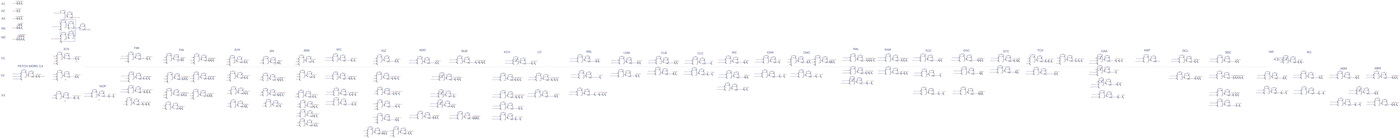
[diagram p0: schematic micro_instructions.asc, whole sheet]
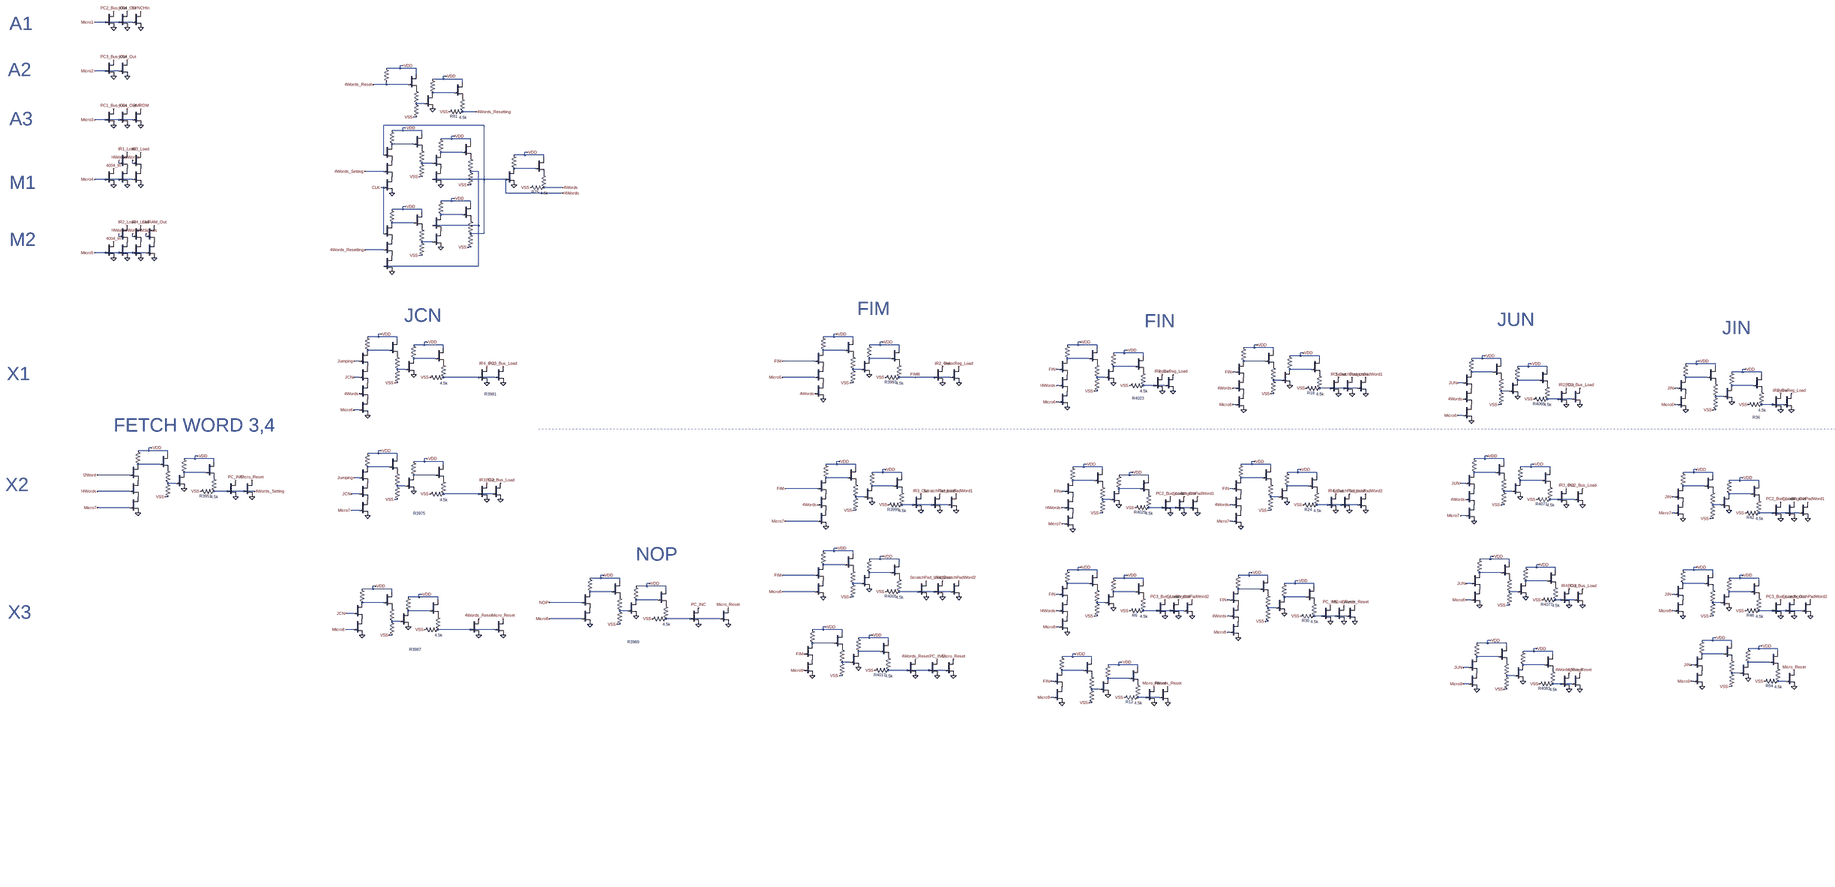
[diagram p1: schematic micro_instructions.asc, part, row 1 of 1, column 1 of 5]
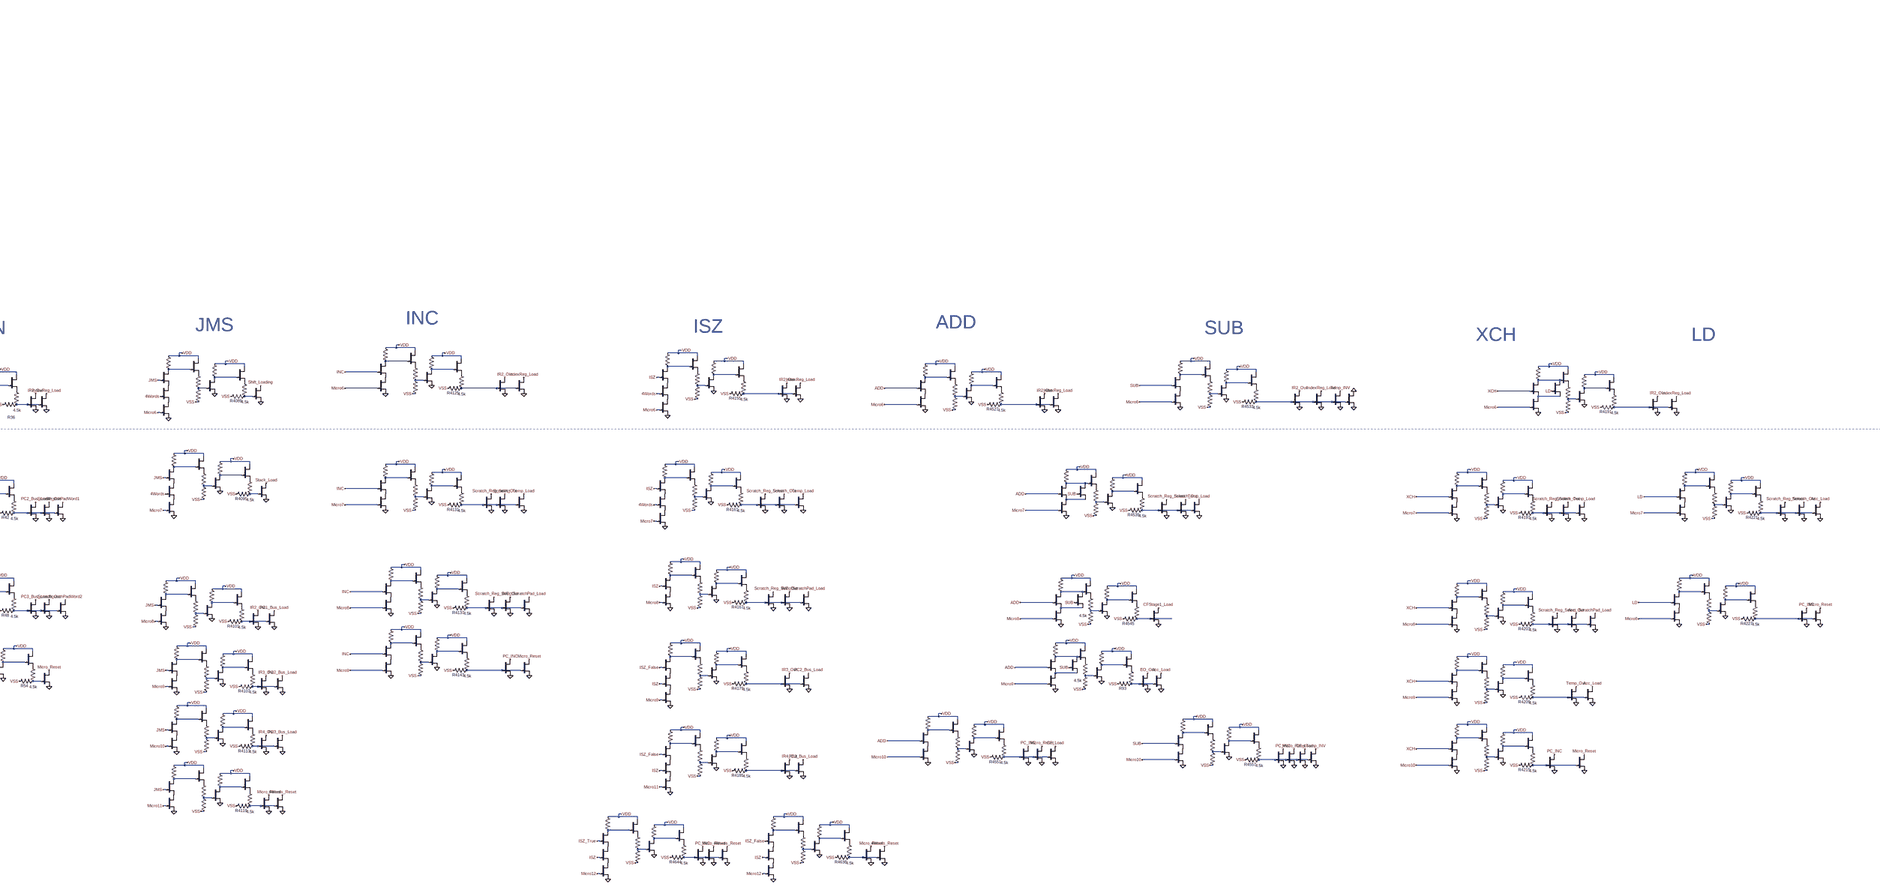
[diagram p2: schematic micro_instructions.asc, part, row 1 of 1, column 2 of 5]
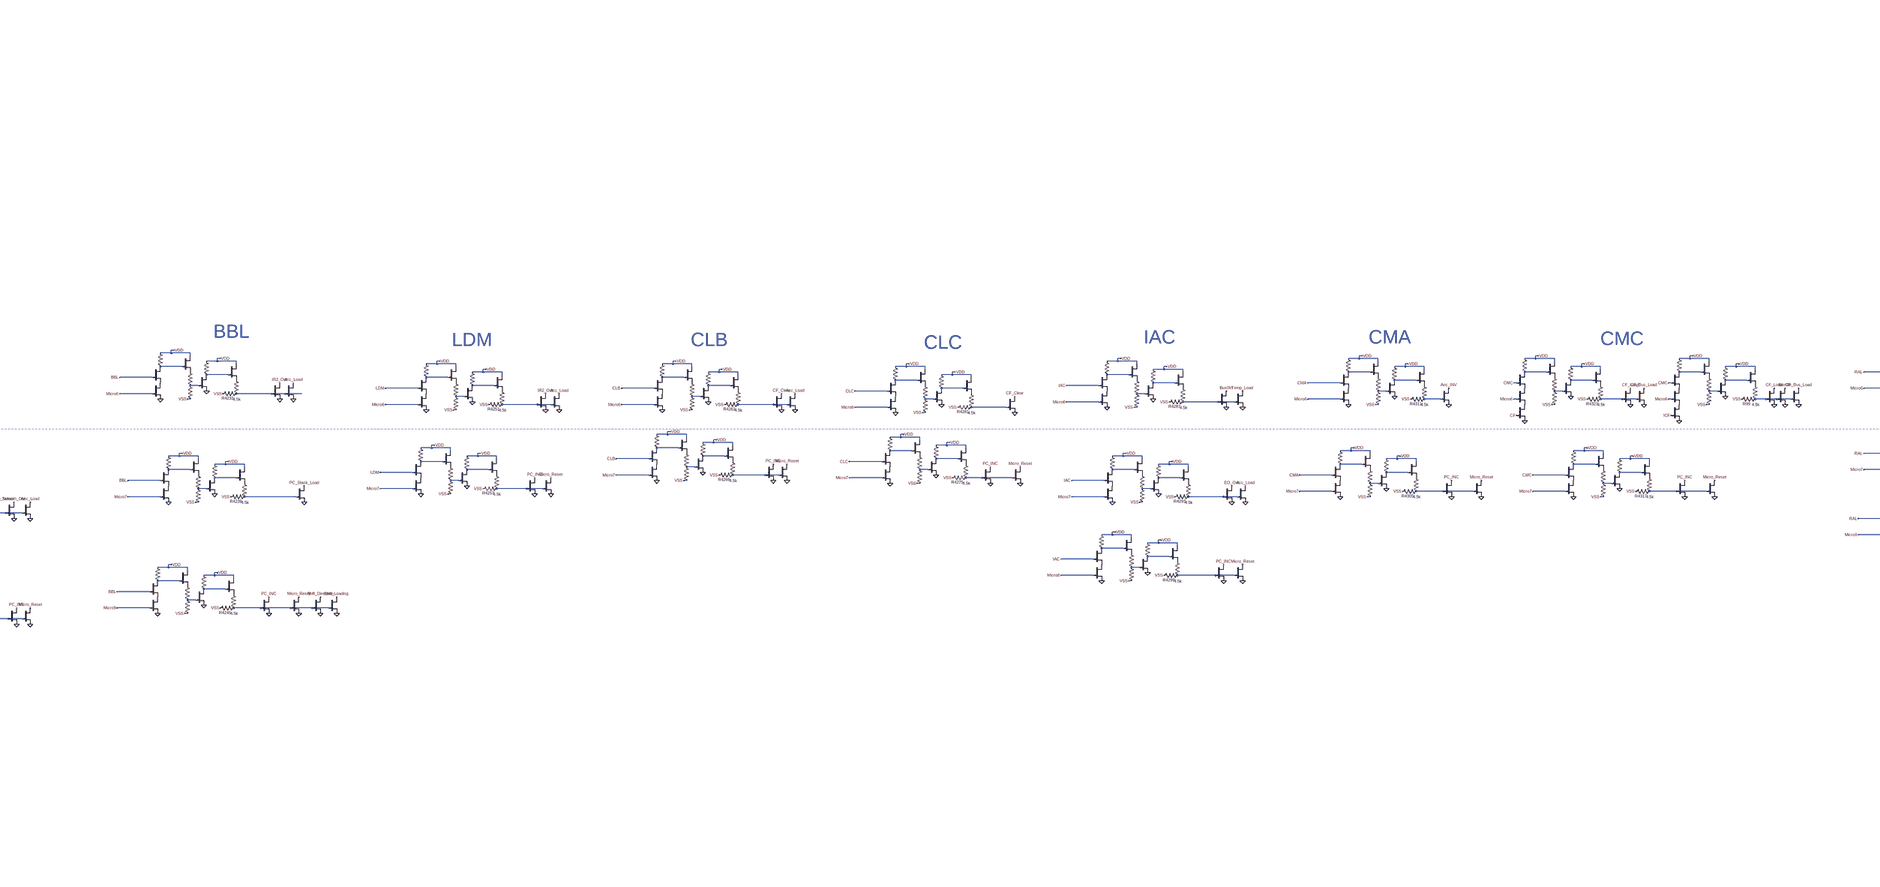
[diagram p3: schematic micro_instructions.asc, part, row 1 of 1, column 3 of 5]
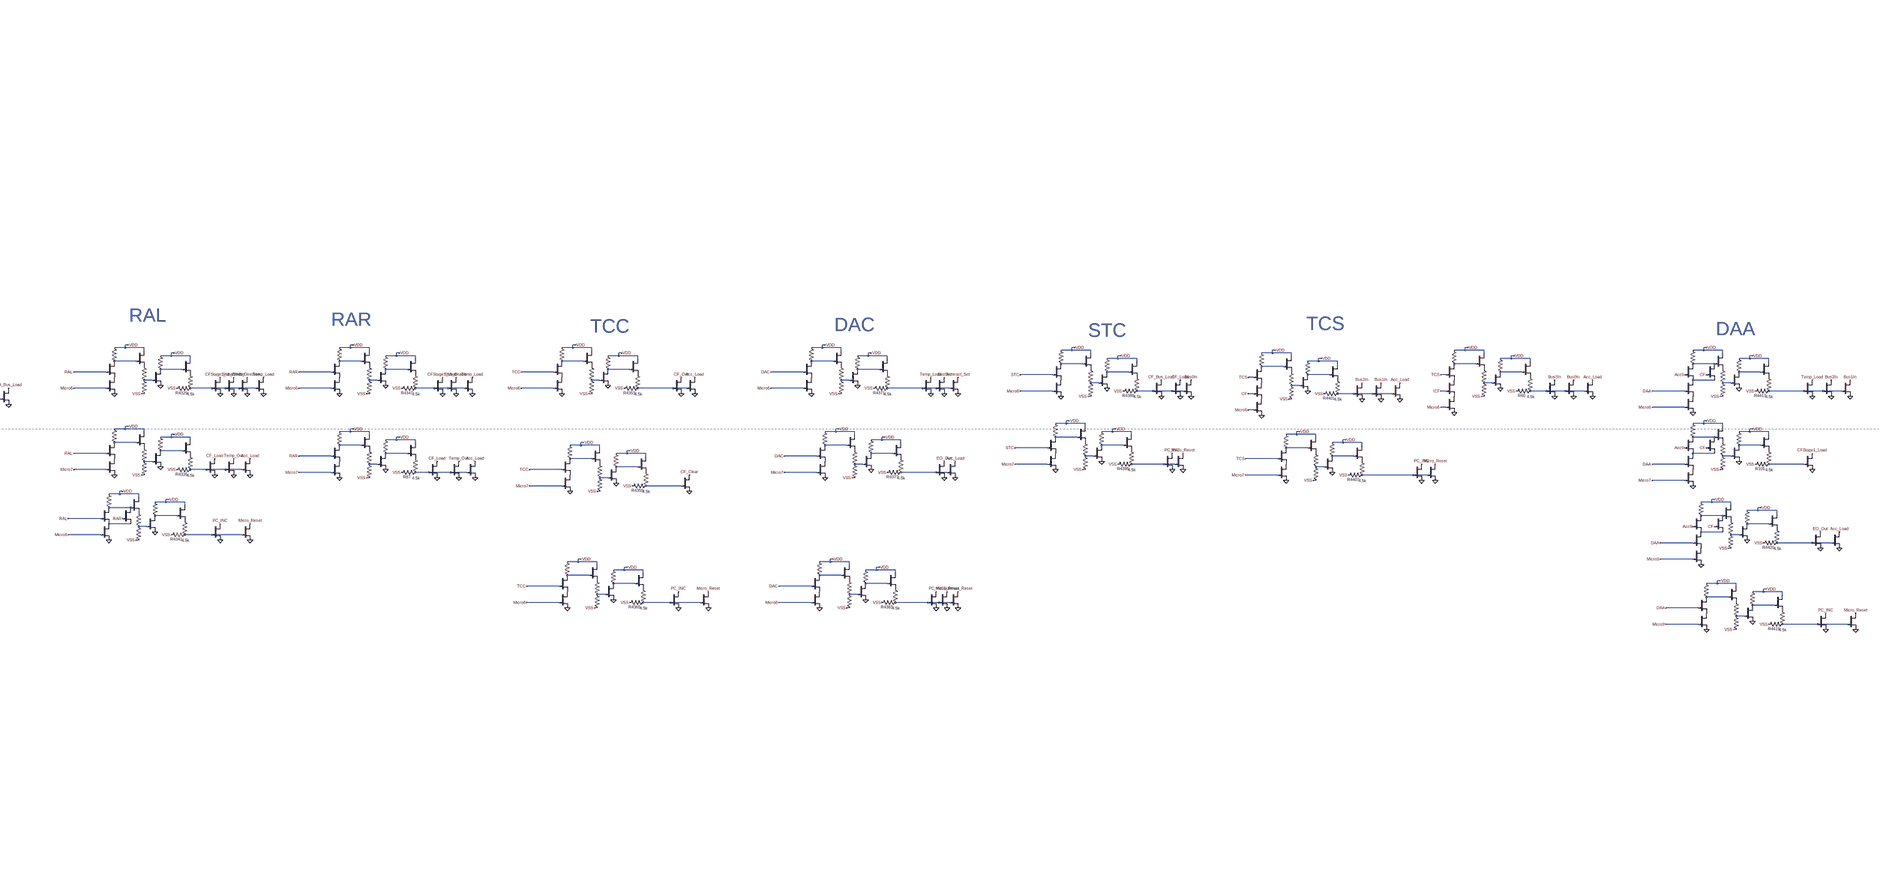
[diagram p4: schematic micro_instructions.asc, part, row 1 of 1, column 4 of 5]
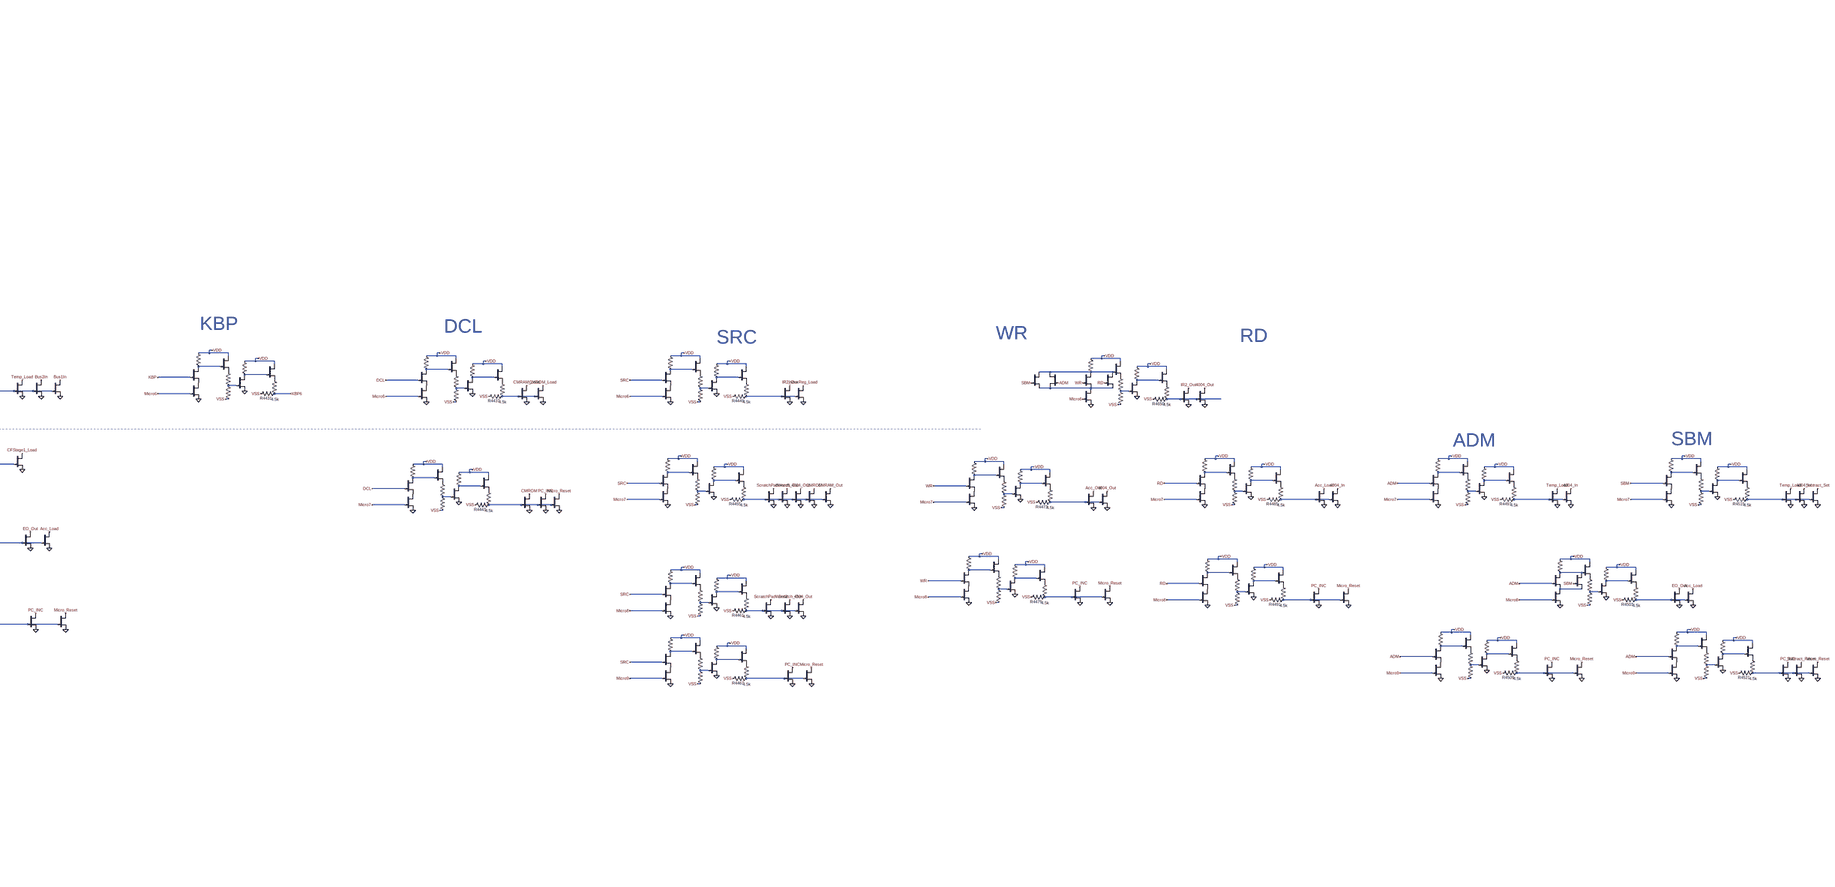
[diagram p5: schematic micro_instructions.asc, part, row 1 of 1, column 5 of 5]
* micro_instructions.asc
J_A2427 N162 !2Word P001 DR
R3946 VDD N162 100k
J_F997 VDD N162 P002 DR
R3947 P002 N210 1k
R3948 N210 VSS 4.8k
J_B1135 P003 Micro7 0 DR
J_A2428 N179 N210 0 DR
R3949 VDD N179 50k
J_F998 VDD N179 P004 DR
R3950 P004 4Words_Setting 1k
R3951 4Words_Setting VSS 4.5k
J_Input15 PC2_Bus_Out Micro1 0 DR
J_Input16 4004_Out Micro1 0 DR
J_Input17 PC3_Bus_Out Micro2 0 DR
J_Input18 4004_Out Micro2 0 DR
J_Input21 PC1_Bus_Out Micro3 0 DR
J_Input22 4004_Out Micro3 0 DR
J_Input23 P005 Micro4 0 DR
J_Input24 4004_In Micro4 0 DR
J_Input27 RMROM Micro3 0 DR
J_A2433 N314 NOP P006 DR
R3964 VDD N314 100k
J_F1003 VDD N314 P007 DR
R3965 P007 N355 1k
R3966 N355 VSS 4.8k
J_B1138 P006 Micro8 0 DR
J_A2434 N332 N355 0 DR
R3967 VDD N332 50k
J_F1004 VDD N332 P008 DR
R3968 P008 N365 1k
R3969 N365 VSS 4.5k
J_Input29 PC_INC N365 0 DR
J_Input30 Micro_Reset N365 0 DR
J_A2435 P009 JCN P010 DR
R3970 VDD N169 100k
J_F1005 VDD N169 P011 DR
R3971 P011 N215 1k
R3972 N215 VSS 4.8k
J_B1139 P010 Micro7 0 DR
J_A2436 N189 N215 0 DR
R3973 VDD N189 50k
J_F1006 VDD N189 P012 DR
R3974 P012 N238 1k
R3975 N238 VSS 4.5k
J_Input31 IR3_Out N238 0 DR
J_Input32 PC2_Bus_Load N238 0 DR
J_A2437 P013 JCN P014 DR
R3976 VDD N011 100k
J_F1007 VDD N011 P015 DR
R3977 P015 N030 1k
R3978 N030 VSS 4.8k
J_B1140 P016 Micro6 0 DR
J_A2438 N013 N030 0 DR
R3979 VDD N013 50k
J_F1008 VDD N013 P017 DR
R3980 P017 N055 1k
R3981 N055 VSS 4.5k
J_Input33 IR4_Out N055 0 DR
J_Input34 PC3_Bus_Load N055 0 DR
J_A2439 N340 JCN P018 DR
R3982 VDD N340 100k
J_F1009 VDD N340 P019 DR
R3983 P019 N368 1k
R3984 N368 VSS 4.8k
J_B1141 P018 Micro8 0 DR
J_A2440 N354 N368 0 DR
R3985 VDD N354 50k
J_F1010 VDD N354 P020 DR
R3986 P020 N372 1k
R3987 N372 VSS 4.5k
J_Input35 Micro_Reset N372 0 DR
J_A2441 N011 Jumping P013 DR
J_A2442 N169 Jumping P009 DR
J_A2443 N012 FIM P021 DR
R3988 VDD N012 100k
J_F1011 VDD N012 P022 DR
R3989 P022 N031 1k
R3990 N031 VSS 4.8k
J_B1142 P021 Micro6 P023 DR
J_A2444 N014 N031 0 DR
R3991 VDD N014 50k
J_F1012 VDD N014 P024 DR
R3992 P024 FIM8 1k
R3993 FIM8 VSS 4.5k
J_Input36 IR2_Out FIM8 0 DR
J_Input38 IndexReg_Load FIM8 0 DR
J_A2445 N194 FIM P025 DR
R3994 VDD N194 100k
J_F1013 VDD N194 P026 DR
R3995 P026 N244 1k
R3996 N244 VSS 4.8k
J_B1143 P027 Micro7 0 DR
J_A2446 N216 N244 0 DR
R3997 VDD N216 50k
J_F1014 VDD N216 P028 DR
R3998 P028 N260 1k
R3999 N260 VSS 4.5k
J_Input39 IR3_Out N260 0 DR
J_Input40 ScratchPad_Load N260 0 DR
J_A2447 N285 FIM P029 DR
R4000 VDD N285 100k
J_F1015 VDD N285 P030 DR
R4001 P030 N302 1k
R4002 N302 VSS 4.8k
J_B1144 P029 Micro8 0 DR
J_A2448 N288 N302 0 DR
R4003 VDD N288 50k
J_F1016 VDD N288 P031 DR
R4004 P031 N315 1k
R4005 N315 VSS 4.5k
J_Input41 IR4_Out N315 0 DR
J_Input43 ScratchPad_Load N315 0 DR
J_A2451 N373 FIM P032 DR
R4012 VDD N373 100k
J_F1019 VDD N373 P033 DR
R4013 P033 N388 1k
R4014 N388 VSS 4.8k
J_B1146 P032 Micro9 0 DR
J_A2452 N377 N388 0 DR
R4015 VDD N377 50k
J_F1020 VDD N377 P034 DR
R4016 P034 N397 1k
R4017 N397 VSS 4.5k
J_Input46 PC_INC N397 0 DR
J_Input47 Micro_Reset N397 0 DR
J_Input49 IndexReg_Load N083 0 DR
J_A2453 N015 FIN P035 DR
R4018 VDD N015 100k
J_F1021 VDD N015 P036 DR
R4019 P036 N056 1k
R4020 N056 VSS 4.8k
J_B1147 P037 Micro6 0 DR
J_A2454 N025 N056 0 DR
R4021 VDD N025 50k
J_F1022 VDD N025 P038 DR
R4022 P038 N083 1k
R4023 N083 VSS 4.5k
J_Input50 IR2_Out N083 0 DR
J_A2455 N203 FIN P039 DR
R4024 VDD N203 100k
J_F1023 VDD N203 P040 DR
R4025 P040 N251 1k
R4026 N251 VSS 4.8k
J_B1148 P041 Micro7 0 DR
J_A2456 N226 N251 0 DR
R4027 VDD N226 50k
J_F1024 VDD N226 P042 DR
R4028 P042 N268 1k
R4029 N268 VSS 4.5k
J_Input51 PC2_Bus_Load N268 0 DR
J_Input53 Scratch_Out N268 0 DR
J_Input59 PC_INC N362 0 DR
J_Input60 Micro_Reset N362 0 DR
J_A2467 N041 JUN P043 DR
R4060 VDD N041 100k
J_F1035 VDD N041 P044 DR
R4061 P044 N104 1k
R4062 N104 VSS 4.8k
J_B1154 P045 Micro6 0 DR
J_A2468 N065 N104 0 DR
R4063 VDD N065 50k
J_F1036 VDD N065 P046 DR
R4064 P046 N125 1k
R4065 N125 VSS 4.5k
J_Input71 IR2_Out N125 0 DR
J_Input72 PC1_Bus_Load N125 0 DR
J_A2469 N180 JUN P047 DR
R4066 VDD N180 100k
J_F1037 VDD N180 P048 DR
R4067 P048 N230 1k
R4068 N230 VSS 4.8k
J_B1155 P049 Micro7 0 DR
J_A2470 N204 N230 0 DR
R4069 VDD N204 50k
J_F1038 VDD N204 P050 DR
R4070 P050 N252 1k
R4071 N252 VSS 4.5k
J_Input73 IR3_Out N252 0 DR
J_Input74 PC2_Bus_Load N252 0 DR
J_A2471 N289 JUN P051 DR
R4072 VDD N289 100k
J_F1039 VDD N289 P052 DR
R4073 P052 N317 1k
R4074 N317 VSS 4.8k
J_B1156 P051 Micro8 0 DR
J_A2472 N297 N317 0 DR
R4075 VDD N297 50k
J_F1040 VDD N297 P053 DR
R4076 P053 N333 1k
R4077 N333 VSS 4.5k
J_Input75 IR4_Out N333 0 DR
J_Input76 PC3_Bus_Load N333 0 DR
J_A2473 N383 JUN P054 DR
R4078 VDD N383 100k
J_F1041 VDD N383 P055 DR
R4079 P055 N406 1k
R4080 N406 VSS 4.8k
J_B1157 P054 Micro9 0 DR
J_A2474 N391 N406 0 DR
R4081 VDD N391 50k
J_F1042 VDD N391 P056 DR
R4082 P056 N414 1k
R4083 N414 VSS 4.5k
J_Input78 Micro_Reset N414 0 DR
J_A2475 N033 JMS P057 DR
R4084 VDD N033 100k
J_F1043 VDD N033 P058 DR
R4085 P058 N093 1k
R4086 N093 VSS 4.8k
J_B1158 P059 Micro6 0 DR
J_A2476 N058 N093 0 DR
R4087 VDD N058 50k
J_F1044 VDD N058 P060 DR
R4088 P060 N118 1k
R4089 N118 VSS 4.5k
J_Input94 Shift_Loading N118 0 DR
J_A2477 N170 JMS P061 DR
R4090 VDD N170 100k
J_F1045 VDD N170 P062 DR
R4091 P062 N219 1k
R4092 N219 VSS 4.8k
J_B1159 P063 Micro7 0 DR
J_A2478 N190 N219 0 DR
R4093 VDD N190 50k
J_F1046 VDD N190 P064 DR
R4094 P064 N240 1k
R4095 N240 VSS 4.5k
J_Input95 Stack_Load N240 0 DR
J_A2479 N324 JMS P065 DR
R4096 VDD N324 100k
J_F1047 VDD N324 P066 DR
R4097 P066 N361 1k
R4098 N361 VSS 4.8k
J_B1160 P065 Micro8 0 DR
J_A2480 N343 N361 0 DR
R4099 VDD N343 50k
J_F1048 VDD N343 P067 DR
R4100 P067 N369 1k
R4101 N369 VSS 4.5k
J_Input96 IR2_Out N369 0 DR
J_Input97 PC1_Bus_Load N369 0 DR
J_A2481 N386 JMS P068 DR
R4102 VDD N386 100k
J_F1049 VDD N386 P069 DR
R4103 P069 N410 1k
R4104 N410 VSS 4.8k
J_B1161 P068 Micro9 0 DR
J_A2482 N396 N410 0 DR
R4105 VDD N396 50k
J_F1050 VDD N396 P070 DR
R4106 P070 N417 1k
R4107 N417 VSS 4.5k
J_Input98 IR3_Out N417 0 DR
J_Input99 PC2_Bus_Load N417 0 DR
J_A2483 N422 JMS P071 DR
R4108 VDD N422 100k
J_F1051 VDD N422 P072 DR
R4109 P072 N426 1k
R4110 N426 VSS 4.8k
J_B1162 P071 Micro10 0 DR
J_A2484 N423 N426 0 DR
R4111 VDD N423 50k
J_F1052 VDD N423 P073 DR
R4112 P073 N431 1k
R4113 N431 VSS 4.5k
J_Input100 IR4_Out N431 0 DR
J_Input101 PC3_Bus_Load N431 0 DR
J_A2485 N442 JMS P074 DR
R4114 VDD N442 100k
J_F1053 VDD N442 P075 DR
R4115 P075 N444 1k
R4116 N444 VSS 4.8k
J_B1163 P074 Micro11 0 DR
J_A2486 N443 N444 0 DR
R4117 VDD N443 50k
J_F1054 VDD N443 P076 DR
R4118 P076 N445 1k
R4119 N445 VSS 4.5k
J_Input103 Micro_Reset N445 0 DR
J_A2487 N017 INC P077 DR
R4120 VDD N017 100k
J_F1055 VDD N017 P078 DR
R4121 P078 N066 1k
R4122 N066 VSS 4.8k
J_B1164 P077 Micro6 0 DR
J_A2488 N034 N066 0 DR
R4123 VDD N034 50k
J_F1056 VDD N034 P079 DR
R4124 P079 N094 1k
R4125 N094 VSS 4.5k
J_Input104 IR2_Out N094 0 DR
J_Input105 IndexReg_Load N094 0 DR
J_A2489 N196 INC P080 DR
R4126 VDD N196 100k
J_F1057 VDD N196 P081 DR
R4127 P081 N246 1k
R4128 N246 VSS 4.8k
J_B1165 P080 Micro7 0 DR
J_A2490 N220 N246 0 DR
R4129 VDD N220 50k
J_F1058 VDD N220 P082 DR
R4130 P082 N263 1k
R4131 N263 VSS 4.5k
J_Input106 Scratch_Out N263 0 DR
J_Input107 ScratchPad_Load N351 0 DR
J_A2491 N298 INC P083 DR
R4132 VDD N298 100k
J_F1059 VDD N298 P084 DR
R4133 P084 N334 1k
R4134 N334 VSS 4.8k
J_B1166 P083 Micro8 0 DR
J_A2492 N310 N334 0 DR
R4135 VDD N310 50k
J_F1060 VDD N310 P085 DR
R4136 P085 N351 1k
R4137 N351 VSS 4.5k
J_Input108 INC_Out N351 0 DR
J_Input109 Temp_Load N263 0 DR
J_A2493 N374 INC P086 DR
R4138 VDD N374 100k
J_F1061 VDD N374 P087 DR
R4139 P087 N390 1k
R4140 N390 VSS 4.8k
J_B1167 P086 Micro9 0 DR
J_A2494 N378 N390 0 DR
R4141 VDD N378 50k
J_F1062 VDD N378 P088 DR
R4142 P088 N399 1k
R4143 N399 VSS 4.5k
J_Input112 PC_INC N399 0 DR
J_Input113 Micro_Reset N399 0 DR
J_A2497 N026 ISZ P089 DR
R4150 VDD N026 100k
J_F1065 VDD N026 P090 DR
R4151 P090 N085 1k
R4152 N085 VSS 4.8k
J_B1169 P091 Micro6 0 DR
J_A2498 N049 N085 0 DR
R4153 VDD N049 50k
J_F1066 VDD N049 P092 DR
R4154 P092 N112 1k
R4155 N112 VSS 4.5k
J_Input114 IR2_Out N112 0 DR
J_Input115 IndexReg_Load N112 0 DR
J_A2499 N197 ISZ P093 DR
R4156 VDD N197 100k
J_F1067 VDD N197 P094 DR
R4157 P094 N247 1k
R4158 N247 VSS 4.8k
J_B1170 P095 Micro7 0 DR
J_A2500 N221 N247 0 DR
R4159 VDD N221 50k
J_F1068 VDD N221 P096 DR
R4160 P096 N264 1k
R4161 N264 VSS 4.5k
J_Input116 Scratch_Out N264 0 DR
J_A2501 N292 ISZ P097 DR
R4162 VDD N292 100k
J_F1069 VDD N292 P098 DR
R4163 P098 N325 1k
R4164 N325 VSS 4.8k
J_B1171 P097 Micro8 0 DR
J_A2502 N305 N325 0 DR
R4165 VDD N305 50k
J_F1070 VDD N305 P099 DR
R4166 P099 N344 1k
R4167 N344 VSS 4.5k
J_Input119 Temp_Load N264 0 DR
J_Input122 PC_INC N452 0 DR
J_Input123 Micro_Reset N452 0 DR
J_Input124 PC2_Bus_Load N415 0 DR
J_A2505 P100 ISZ P101 DR
R4174 VDD N384 100k
J_F1073 VDD N384 P102 DR
R4175 P102 N407 1k
R4176 N407 VSS 4.8k
J_B1173 P101 Micro9 0 DR
J_A2506 N392 N407 0 DR
R4177 VDD N392 50k
J_F1074 VDD N392 P103 DR
R4178 P103 N415 1k
R4179 N415 VSS 4.5k
J_Input125 IR3_Out N415 0 DR
J_A2507 P104 ISZ P105 DR
R4180 VDD N430 100k
J_F1075 VDD N430 P106 DR
R4181 P106 N439 1k
R4182 N439 VSS 4.8k
J_B1174 P105 Micro11 0 DR
J_A2508 N434 N439 0 DR
R4183 VDD N434 50k
J_F1076 VDD N434 P107 DR
R4184 P107 N441 1k
R4185 N441 VSS 4.5k
J_Input126 IR4_Out N441 0 DR
J_Input127 PC3_Bus_Load N441 0 DR
J_A2509 N384 ISZ_False P100 DR
J_A2510 N430 ISZ_False P104 DR
J_A2511 N067 XCH N120 DR
R4186 VDD N067 100k
J_F1077 VDD N067 P108 DR
R4187 P108 N126 1k
R4188 N126 VSS 4.8k
J_B1175 N120 Micro6 0 DR
J_A2512 N095 N126 0 DR
R4189 VDD N095 50k
J_F1078 VDD N095 P109 DR
R4190 P109 N138 1k
R4191 N138 VSS 4.5k
J_Input128 IR2_Out N138 0 DR
J_Input129 IndexReg_Load N138 0 DR
J_A2513 N222 XCH P110 DR
R4192 VDD N222 100k
J_F1079 VDD N222 P111 DR
R4193 P111 N265 1k
R4194 N265 VSS 4.8k
J_B1176 P110 Micro7 0 DR
J_A2514 N241 N265 0 DR
R4195 VDD N241 50k
J_F1080 VDD N241 P112 DR
R4196 P112 N272 1k
R4197 N272 VSS 4.5k
J_Input130 Scratch_Out N272 0 DR
J_Input131 Temp_Load N272 0 DR
J_A2515 N329 XCH P113 DR
R4198 VDD N329 100k
J_F1081 VDD N329 P114 DR
R4199 P114 N363 1k
R4200 N363 VSS 4.8k
J_B1177 P113 Micro8 0 DR
J_A2516 N348 N363 0 DR
R4201 VDD N348 50k
J_F1082 VDD N348 P115 DR
R4202 P115 N370 1k
R4203 N370 VSS 4.5k
J_Input132 Acc_Out N370 0 DR
J_Input133 ScratchPad_Load N370 0 DR
J_A2517 N400 XCH P116 DR
R4204 VDD N400 100k
J_F1083 VDD N400 P117 DR
R4205 P117 N419 1k
R4206 N419 VSS 4.8k
J_B1178 P116 Micro9 0 DR
J_A2518 N411 N419 0 DR
R4207 VDD N411 50k
J_F1084 VDD N411 P118 DR
R4208 P118 N421 1k
R4209 N421 VSS 4.5k
J_Input134 Temp_Out N421 0 DR
J_Input135 Acc_Load N421 0 DR
J_A2519 N428 XCH P119 DR
R4210 VDD N428 100k
J_F1085 VDD N428 P120 DR
R4211 P120 N437 1k
R4212 N437 VSS 4.8k
J_B1179 P119 Micro10 0 DR
J_A2520 N432 N437 0 DR
R4213 VDD N432 50k
J_F1086 VDD N432 P121 DR
R4214 P121 N440 1k
R4215 N440 VSS 4.5k
J_Input136 PC_INC N440 0 DR
J_Input137 Micro_Reset N440 0 DR
J_A2521 N223 LD P122 DR
R4216 VDD N223 100k
J_F1087 VDD N223 P123 DR
R4217 P123 N266 1k
R4218 N266 VSS 4.8k
J_B1180 P122 Micro7 0 DR
J_A2522 N242 N266 0 DR
R4219 VDD N242 50k
J_F1088 VDD N242 P124 DR
R4220 P124 N273 1k
R4221 N273 VSS 4.5k
J_Input138 Scratch_Out N273 0 DR
J_Input139 Acc_Load N273 0 DR
J_A2523 N067 LD N120 DR
J_A2524 N320 LD P125 DR
R4222 VDD N320 100k
J_F1089 VDD N320 P126 DR
R4223 P126 N359 1k
R4224 N359 VSS 4.8k
J_B1181 P125 Micro8 0 DR
J_A2525 N336 N359 0 DR
R4225 VDD N336 50k
J_F1090 VDD N336 P127 DR
R4226 P127 N367 1k
R4227 N367 VSS 4.5k
J_Input140 PC_INC N367 0 DR
J_Input141 Micro_Reset N367 0 DR
J_A2526 N027 BBL P128 DR
R4228 VDD N027 100k
J_F1091 VDD N027 P129 DR
R4229 P129 N087 1k
R4230 N087 VSS 4.8k
J_B1182 P128 Micro6 0 DR
J_A2527 N051 N087 0 DR
R4231 VDD N051 50k
J_F1092 VDD N051 P130 DR
R4232 P130 N114 1k
R4233 N114 VSS 4.5k
J_Input142 IR2_Out N114 0 DR
J_Input143 Acc_Load N114 0 DR
J_Input144 Shift_Direction N353 0 DR
J_Input145 Shift_Loading N353 0 DR
J_A2528 N174 BBL P131 DR
R4234 VDD N174 100k
J_F1093 VDD N174 P132 DR
R4235 P132 N227 1k
R4236 N227 VSS 4.8k
J_B1183 P131 Micro7 0 DR
J_A2529 N198 N227 0 DR
R4237 VDD N198 50k
J_F1094 VDD N198 P133 DR
R4238 P133 N248 1k
R4239 N248 VSS 4.5k
J_Input146 PC_Stack_Load N248 0 DR
J_A2530 N299 BBL P134 DR
R4240 VDD N299 100k
J_F1095 VDD N299 P135 DR
R4241 P135 N337 1k
R4242 N337 VSS 4.8k
J_B1184 P134 Micro8 0 DR
J_A2531 N311 N337 0 DR
R4243 VDD N311 50k
J_F1096 VDD N311 P136 DR
R4244 P136 N353 1k
R4245 N353 VSS 4.5k
J_Input147 PC_INC N353 0 DR
J_Input148 Micro_Reset N353 0 DR
J_A2532 N060 LDM P137 DR
R4246 VDD N060 100k
J_F1097 VDD N060 P138 DR
R4247 P138 N121 1k
R4248 N121 VSS 4.8k
J_B1185 P137 Micro6 0 DR
J_A2533 N088 N121 0 DR
R4249 VDD N088 50k
J_F1098 VDD N088 P139 DR
R4250 P139 N136 1k
R4251 N136 VSS 4.5k
J_Input149 IR2_Out N136 0 DR
J_Input150 Acc_Load N136 0 DR
J_A2534 N160 LDM P140 DR
R4252 VDD N160 100k
J_F1099 VDD N160 P141 DR
R4253 P141 N205 1k
R4254 N205 VSS 4.8k
J_B1186 P140 Micro7 0 DR
J_A2535 N175 N205 0 DR
R4255 VDD N175 50k
J_F1100 VDD N175 P142 DR
R4256 P142 N228 1k
R4257 N228 VSS 4.5k
J_Input151 PC_INC N228 0 DR
J_Input152 Micro_Reset N228 0 DR
J_Input153 Acc_Load N137 0 DR
J_A2536 N061 CLB P143 DR
R4258 VDD N061 100k
J_F1101 VDD N061 P144 DR
R4259 P144 N122 1k
R4260 N122 VSS 4.8k
J_B1187 P143 Micro6 0 DR
J_A2537 N089 N122 0 DR
R4261 VDD N089 50k
J_F1102 VDD N089 P145 DR
R4262 P145 N137 1k
R4263 N137 VSS 4.5k
J_Input154 CF_Clear N137 0 DR
J_A2538 N147 CLB P146 DR
R4264 VDD N147 100k
J_F1103 VDD N147 P147 DR
R4265 P147 N171 1k
R4266 N171 VSS 4.8k
J_B1188 P146 Micro7 0 DR
J_A2539 N154 N171 0 DR
R4267 VDD N154 50k
J_F1104 VDD N154 P148 DR
R4268 P148 N191 1k
R4269 N191 VSS 4.5k
J_Input155 PC_INC N191 0 DR
J_Input156 Micro_Reset N191 0 DR
J_A2540 N149 CLC P149 DR
R4270 VDD N149 100k
J_F1105 VDD N149 P150 DR
R4271 P150 N176 1k
R4272 N176 VSS 4.8k
J_B1189 P149 Micro7 0 DR
J_A2541 N158 N176 0 DR
R4273 VDD N158 50k
J_F1106 VDD N158 P151 DR
R4274 P151 N199 1k
R4275 N199 VSS 4.5k
J_Input157 PC_INC N199 0 DR
J_Input158 Micro_Reset N199 0 DR
J_A2542 N068 CLC P152 DR
R4276 VDD N068 100k
J_F1107 VDD N068 P153 DR
R4277 P153 N127 1k
R4278 N127 VSS 4.8k
J_B1190 P152 Micro6 0 DR
J_A2543 N096 N127 0 DR
R4279 VDD N096 50k
J_F1108 VDD N096 P154 DR
R4280 P154 N139 1k
R4281 N139 VSS 4.5k
J_Input159 CF_Clear N139 0 DR
J_Input160 Temp_Load N133 0 DR
J_A2544 N052 IAC P155 DR
R4282 VDD N052 100k
J_F1109 VDD N052 P156 DR
R4283 P156 N115 1k
R4284 N115 VSS 4.8k
J_B1191 P155 Micro6 0 DR
J_A2545 N079 N115 0 DR
R4285 VDD N079 50k
J_F1110 VDD N079 P157 DR
R4286 P157 N133 1k
R4287 N133 VSS 4.5k
J_Input161 Bus0In N133 0 DR
J_A2546 N177 IAC P158 DR
R4288 VDD N177 100k
J_F1111 VDD N177 P159 DR
R4289 P159 N229 1k
R4290 N229 VSS 4.8k
J_B1192 P158 Micro7 0 DR
J_A2547 N200 N229 0 DR
R4291 VDD N200 50k
J_F1112 VDD N200 P160 DR
R4292 P160 N249 1k
R4293 N249 VSS 4.5k
J_Input162 EO_Out N249 0 DR
J_Input163 Acc_Load N249 0 DR
J_A2548 N283 IAC P161 DR
R4294 VDD N283 100k
J_F1113 VDD N283 P162 DR
R4295 P162 N286 1k
R4296 N286 VSS 4.8k
J_B1193 P161 Micro8 0 DR
J_A2549 N284 N286 0 DR
R4297 VDD N284 50k
J_F1114 VDD N284 P163 DR
R4298 P163 N293 1k
R4299 N293 VSS 4.5k
J_Input164 PC_INC N293 0 DR
J_Input165 Micro_Reset N293 0 DR
J_A2550 N163 CMA P164 DR
R4300 VDD N163 100k
J_F1115 VDD N163 P165 DR
R4301 P165 N212 1k
R4302 N212 VSS 4.8k
J_B1194 P164 Micro7 0 DR
J_A2551 N181 N212 0 DR
R4303 VDD N181 50k
J_F1116 VDD N181 P166 DR
R4304 P166 N232 1k
R4305 N232 VSS 4.5k
J_Input166 PC_INC N232 0 DR
J_Input167 Micro_Reset N232 0 DR
J_A2552 N042 CMA P167 DR
R4306 VDD N042 100k
J_F1117 VDD N042 P168 DR
R4307 P168 N105 1k
R4308 N105 VSS 4.8k
J_B1195 P167 Micro6 0 DR
J_A2553 N069 N105 0 DR
R4309 VDD N069 50k
J_F1118 VDD N069 P169 DR
R4310 P169 N128 1k
R4311 N128 VSS 4.5k
J_Input168 Acc_INV N128 0 DR
J_A2554 N164 CMC P170 DR
R4312 VDD N164 100k
J_F1119 VDD N164 P171 DR
R4313 P171 N213 1k
R4314 N213 VSS 4.8k
J_B1196 P170 Micro7 0 DR
J_A2555 N182 N213 0 DR
R4315 VDD N182 50k
J_F1120 VDD N182 P172 DR
R4316 P172 N233 1k
R4317 N233 VSS 4.5k
J_Input169 PC_INC N233 0 DR
J_Input170 Micro_Reset N233 0 DR
J_A2556 N043 CMC P173 DR
R4318 VDD N043 100k
J_F1121 VDD N043 P174 DR
R4319 P174 N106 1k
R4320 N106 VSS 4.8k
J_B1197 P173 Micro6 P175 DR
J_A2557 N070 N106 0 DR
R4321 VDD N070 50k
J_F1122 VDD N070 P176 DR
R4322 P176 N129 1k
R4323 N129 VSS 4.5k
J_Input171 CF_Bus_Load N129 0 DR
J_A2558 N018 RAL P177 DR
R4324 VDD N018 100k
J_F1123 VDD N018 P178 DR
R4325 P178 N072 1k
R4326 N072 VSS 4.8k
J_B1198 P177 Micro6 0 DR
J_A2559 N035 N072 0 DR
R4327 VDD N035 50k
J_F1124 VDD N035 P179 DR
R4328 P179 N097 1k
R4329 N097 VSS 4.5k
J_Input172 Shift_Enable N097 0 DR
J_Input173 Temp_Load N097 0 DR
J_Input174 Shift_Direction N097 0 DR
J_A2560 N142 RAL P180 DR
R4330 VDD N142 100k
J_F1125 VDD N142 P181 DR
R4331 P181 N161 1k
R4332 N161 VSS 4.8k
J_B1199 P180 Micro7 0 DR
J_A2561 N150 N161 0 DR
R4333 VDD N150 50k
J_F1126 VDD N150 P182 DR
R4334 P182 N178 1k
R4335 N178 VSS 4.5k
J_Input175 Temp_Out N178 0 DR
J_Input176 Acc_Load N178 0 DR
J_A2562 N269 RAL N276 DR
R4336 VDD N269 100k
J_F1127 VDD N269 P183 DR
R4337 P183 N278 1k
R4338 N278 VSS 4.8k
J_B1200 N276 Micro8 0 DR
J_A2563 N274 N278 0 DR
R4339 VDD N274 50k
J_F1128 VDD N274 P184 DR
R4340 P184 N280 1k
R4341 N280 VSS 4.5k
J_Input177 PC_INC N280 0 DR
J_Input178 Micro_Reset N280 0 DR
J_A2564 N019 RAR P185 DR
R4342 VDD N019 100k
J_F1129 VDD N019 P186 DR
R4343 P186 N073 1k
R4344 N073 VSS 4.8k
J_B1201 P185 Micro6 0 DR
J_A2565 N036 N073 0 DR
R4345 VDD N036 50k
J_F1130 VDD N036 P187 DR
R4346 P187 N098 1k
R4347 N098 VSS 4.5k
J_A2567 N269 RAR N276 DR
J_A2568 N020 TCC P188 DR
R4348 VDD N020 100k
J_F1131 VDD N020 P189 DR
R4349 P189 N074 1k
R4350 N074 VSS 4.8k
J_B1202 P188 Micro6 0 DR
J_A2569 N037 N074 0 DR
R4351 VDD N037 50k
J_F1132 VDD N037 P190 DR
R4352 P190 N099 1k
R4353 N099 VSS 4.5k
J_Input181 CF_Out N099 0 DR
J_Input182 Acc_Load N099 0 DR
J_A2570 N159 TCC P191 DR
R4354 VDD N159 100k
J_F1133 VDD N159 P192 DR
R4355 P192 N201 1k
R4356 N201 VSS 4.8k
J_B1203 P191 Micro7 0 DR
J_A2571 N172 N201 0 DR
R4357 VDD N172 50k
J_F1134 VDD N172 P193 DR
R4358 P193 N224 1k
R4359 N224 VSS 4.5k
J_Input183 CF_Clear N224 0 DR
J_A2572 N294 TCC P194 DR
R4360 VDD N294 100k
J_F1135 VDD N294 P195 DR
R4361 P195 N326 1k
R4362 N326 VSS 4.8k
J_B1204 P194 Micro8 0 DR
J_A2573 N306 N326 0 DR
R4363 VDD N306 50k
J_F1136 VDD N306 P196 DR
R4364 P196 N345 1k
R4365 N345 VSS 4.5k
J_Input184 PC_INC N345 0 DR
J_Input185 Micro_Reset N345 0 DR
J_A2574 N021 DAC P197 DR
R4366 VDD N021 100k
J_F1137 VDD N021 P198 DR
R4367 P198 N075 1k
R4368 N075 VSS 4.8k
J_B1205 P197 Micro6 0 DR
J_A2575 N038 N075 0 DR
R4369 VDD N038 50k
J_F1138 VDD N038 P199 DR
R4370 P199 N100 1k
R4371 N100 VSS 4.5k
J_Input186 Bus0In N100 0 DR
J_Input187 Temp_Load N100 0 DR
J_Input188 Subtract_Set N100 0 DR
J_A2576 N144 DAC P200 DR
R4372 VDD N144 100k
J_F1139 VDD N144 P201 DR
R4373 P201 N166 1k
R4374 N166 VSS 4.8k
J_B1206 P200 Micro7 0 DR
J_A2577 N152 N166 0 DR
R4375 VDD N152 50k
J_F1140 VDD N152 P202 DR
R4376 P202 N184 1k
R4377 N184 VSS 4.5k
J_Input189 EO_Out N184 0 DR
J_Input190 Subtract_Reset N346 0 DR
J_Input191 Acc_Load N184 0 DR
J_A2578 N295 DAC P203 DR
R4378 VDD N295 100k
J_F1141 VDD N295 P204 DR
R4379 P204 N327 1k
R4380 N327 VSS 4.8k
J_B1207 P203 Micro8 0 DR
J_A2579 N307 N327 0 DR
R4381 VDD N307 50k
J_F1142 VDD N307 P205 DR
R4382 P205 N346 1k
R4383 N346 VSS 4.5k
J_Input192 PC_INC N346 0 DR
J_Input193 Micro_Reset N346 0 DR
J_Input194 Bus0In N108 0 DR
J_A2580 N022 STC P206 DR
R4384 VDD N022 100k
J_F1143 VDD N022 P207 DR
R4385 P207 N080 1k
R4386 N080 VSS 4.8k
J_B1208 P206 Micro6 0 DR
J_A2581 N045 N080 0 DR
R4387 VDD N045 50k
J_F1144 VDD N045 P208 DR
R4388 P208 N108 1k
R4389 N108 VSS 4.5k
J_Input195 CF_Load N108 0 DR
J_A2582 N140 STC P209 DR
R4390 VDD N140 100k
J_F1145 VDD N140 P210 DR
R4391 P210 N155 1k
R4392 N155 VSS 4.8k
J_B1209 P209 Micro7 0 DR
J_A2583 N145 N155 0 DR
R4393 VDD N145 50k
J_F1146 VDD N145 P211 DR
R4394 P211 N167 1k
R4395 N167 VSS 4.5k
J_Input196 PC_INC N167 0 DR
J_Input197 Micro_Reset N167 0 DR
J_A2584 N028 TCS P212 DR
R4396 VDD N028 100k
J_F1147 VDD N028 P213 DR
R4397 P213 N090 1k
R4398 N090 VSS 4.8k
J_B1210 P214 Micro6 0 DR
J_A2585 N053 N090 0 DR
R4399 VDD N053 50k
J_F1148 VDD N053 P215 DR
R4400 P215 N116 1k
R4401 N116 VSS 4.5k
J_Input198 Bus3In N116 0 DR
J_A2586 N148 TCS P216 DR
R4402 VDD N148 100k
J_F1149 VDD N148 P217 DR
R4403 P217 N173 1k
R4404 N173 VSS 4.8k
J_B1211 P216 Micro7 0 DR
J_A2587 N156 N173 0 DR
R4405 VDD N156 50k
J_F1150 VDD N156 P218 DR
R4406 P218 N192 1k
R4407 N192 VSS 4.5k
J_Input200 Acc_Load N116 0 DR
J_Input201 PC_INC N192 0 DR
J_Input202 Micro_Reset N192 0 DR
J_A2588 N076 DAA P219 DR
R4408 VDD N024 100k
J_F1151 VDD N024 P220 DR
R4409 P220 N082 1k
R4410 N082 VSS 4.8k
J_B1212 P219 Micro6 0 DR
J_A2589 N047 N082 0 DR
R4411 VDD N047 50k
J_F1152 VDD N047 P221 DR
R4412 P221 N110 1k
R4413 N110 VSS 4.5k
J_Input203 Temp_Load N110 0 DR
J_Input204 Bus2In N110 0 DR
J_A2590 N330 DAA P222 DR
R4414 VDD N330 100k
J_F1153 VDD N330 P223 DR
R4415 P223 N364 1k
R4416 N364 VSS 4.8k
J_B1213 P222 Micro9 0 DR
J_A2591 N349 N364 0 DR
R4417 VDD N349 50k
J_F1154 VDD N349 P224 DR
R4418 P224 N371 1k
R4419 N371 VSS 4.5k
J_Input205 Bus1In N110 0 DR
J_Input206 PC_INC N371 0 DR
J_Input207 Micro_Reset N371 0 DR
J_A2592 N279 DAA P225 DR
R4420 VDD N275 100k
J_F1155 VDD N275 P226 DR
R4421 P226 N281 1k
R4422 N281 VSS 4.8k
J_B1214 P225 Micro8 0 DR
J_A2593 N277 N281 0 DR
R4423 VDD N277 50k
J_F1156 VDD N277 P227 DR
R4424 P227 N282 1k
R4425 N282 VSS 4.5k
J_Input208 EO_Out N282 0 DR
J_Input209 Acc_Load N282 0 DR
J_A2594 N024 Acc9 N076 DR
J_A2595 N024 CF N076 DR
J_A2596 N275 Acc9 N279 DR
J_A2597 N275 CF N279 DR
J_A2598 N029 KBP P228 DR
R4426 VDD N029 100k
J_F1157 VDD N029 P229 DR
R4427 P229 N091 1k
R4428 N091 VSS 4.8k
J_B1215 P228 Micro6 0 DR
J_A2599 N054 N091 0 DR
R4429 VDD N054 50k
J_F1158 VDD N054 P230 DR
R4430 P230 KBP6 1k
R4431 KBP6 VSS 4.5k
J_A2600 N039 DCL P231 DR
R4432 VDD N039 100k
J_F1159 VDD N039 P232 DR
R4433 P232 N101 1k
R4434 N101 VSS 4.8k
J_B1216 P231 Micro6 0 DR
J_A2601 N062 N101 0 DR
R4435 VDD N062 50k
J_F1160 VDD N062 P233 DR
R4436 P233 N123 1k
R4437 N123 VSS 4.5k
J_Input210 CMROM_Load N123 0 DR
J_A2602 N202 DCL P234 DR
R4438 VDD N202 100k
J_F1161 VDD N202 P235 DR
R4439 P235 N250 1k
R4440 N250 VSS 4.8k
J_B1217 P234 Micro7 0 DR
J_A2603 N225 N250 0 DR
R4441 VDD N225 50k
J_F1162 VDD N225 P236 DR
R4442 P236 N267 1k
R4443 N267 VSS 4.5k
J_Input211 CMROM N267 0 DR
J_Input212 PC_INC N267 0 DR
J_Input213 Micro_Reset N267 0 DR
J_A2604 N040 SRC P237 DR
R4444 VDD N040 100k
J_F1163 VDD N040 P238 DR
R4445 P238 N102 1k
R4446 N102 VSS 4.8k
J_B1218 P237 Micro6 0 DR
J_A2605 N063 N102 0 DR
R4447 VDD N063 50k
J_F1164 VDD N063 P239 DR
R4448 P239 N124 1k
R4449 N124 VSS 4.5k
J_Input214 IR2_Out N124 0 DR
J_Input215 IndexReg_Load N124 0 DR
J_A2606 N185 SRC P240 DR
R4450 VDD N185 100k
J_F1165 VDD N185 P241 DR
R4451 P241 N234 1k
R4452 N234 VSS 4.8k
J_B1219 P240 Micro7 0 DR
J_A2607 N206 N234 0 DR
R4453 VDD N206 50k
J_F1166 VDD N206 P242 DR
R4454 P242 N254 1k
R4455 N254 VSS 4.5k
J_Input217 Scratch_Out N254 0 DR
J_Input218 4004_Out N254 0 DR
J_Input219 CMROM N254 0 DR
J_Input220 CMRAM_Out N254 0 DR
J_A2608 N308 SRC P243 DR
R4456 VDD N308 100k
J_F1167 VDD N308 P244 DR
R4457 P244 N347 1k
R4458 N347 VSS 4.8k
J_B1220 P243 Micro8 0 DR
J_A2609 N321 N347 0 DR
R4459 VDD N321 50k
J_F1168 VDD N321 P245 DR
R4460 P245 N360 1k
R4461 N360 VSS 4.5k
J_Input222 Scratch_Out N360 0 DR
J_Input223 4004_Out N360 0 DR
J_A2610 N379 SRC P246 DR
R4462 VDD N379 100k
J_F1169 VDD N379 P247 DR
R4463 P247 N401 1k
R4464 N401 VSS 4.8k
J_B1221 P246 Micro9 0 DR
J_A2611 N387 N401 0 DR
R4465 VDD N387 50k
J_F1170 VDD N387 P248 DR
R4466 P248 N412 1k
R4467 N412 VSS 4.5k
J_Input226 PC_INC N412 0 DR
J_Input227 Micro_Reset N412 0 DR
J_A2612 N193 WR P249 DR
R4468 VDD N193 100k
J_F1171 VDD N193 P250 DR
R4469 P250 N243 1k
R4470 N243 VSS 4.8k
J_B1222 P249 Micro7 0 DR
J_A2613 N214 N243 0 DR
R4471 VDD N214 50k
J_F1172 VDD N214 P251 DR
R4472 P251 N259 1k
R4473 N259 VSS 4.5k
J_Input228 Acc_Out N259 0 DR
J_Input229 4004_Out N259 0 DR
J_A2614 N287 WR P252 DR
R4474 VDD N287 100k
J_F1173 VDD N287 P253 DR
R4475 P253 N312 1k
R4476 N312 VSS 4.8k
J_B1223 P252 Micro8 0 DR
J_A2615 N296 N312 0 DR
R4477 VDD N296 50k
J_F1174 VDD N296 P254 DR
R4478 P254 N331 1k
R4479 N331 VSS 4.5k
J_Input230 PC_INC N331 0 DR
J_Input231 Micro_Reset N331 0 DR
J_A2616 N186 RD P255 DR
R4480 VDD N186 100k
J_F1175 VDD N186 P256 DR
R4481 P256 N235 1k
R4482 N235 VSS 4.8k
J_B1224 P255 Micro7 0 DR
J_A2617 N207 N235 0 DR
R4483 VDD N207 50k
J_F1176 VDD N207 P257 DR
R4484 P257 N255 1k
R4485 N255 VSS 4.5k
J_Input232 Acc_Load N255 0 DR
J_Input233 4004_In N255 0 DR
J_A2618 N290 RD P258 DR
R4486 VDD N290 100k
J_F1177 VDD N290 P259 DR
R4487 P259 N322 1k
R4488 N322 VSS 4.8k
J_B1225 P258 Micro8 0 DR
J_A2619 N300 N322 0 DR
R4489 VDD N300 50k
J_F1178 VDD N300 P260 DR
R4490 P260 N338 1k
R4491 N338 VSS 4.5k
J_Input234 PC_INC N338 0 DR
J_Input235 Micro_Reset N338 0 DR
J_A2620 N187 ADM P261 DR
R4492 VDD N187 100k
J_F1179 VDD N187 P262 DR
R4493 P262 N236 1k
R4494 N236 VSS 4.8k
J_B1226 P261 Micro7 0 DR
J_A2621 N208 N236 0 DR
R4495 VDD N208 50k
J_F1180 VDD N208 P263 DR
R4496 P263 N256 1k
R4497 N256 VSS 4.5k
J_Input236 Temp_Load N256 0 DR
J_Input237 4004_In N256 0 DR
J_A2622 N291 ADM N313 DR
R4498 VDD N291 100k
J_F1181 VDD N291 P264 DR
R4499 P264 N323 1k
R4500 N323 VSS 4.8k
J_B1227 N313 Micro8 0 DR
J_A2623 N301 N323 0 DR
R4501 VDD N301 50k
J_F1182 VDD N301 P265 DR
R4502 P265 N339 1k
R4503 N339 VSS 4.5k
J_Input238 EO_Out N339 0 DR
J_Input239 Acc_Load N339 0 DR
J_A2624 N375 ADM P266 DR
R4504 VDD N375 100k
J_F1183 VDD N375 P267 DR
R4505 P267 N394 1k
R4506 N394 VSS 4.8k
J_B1228 P266 Micro9 0 DR
J_A2625 N381 N394 0 DR
R4507 VDD N381 50k
J_F1184 VDD N381 P268 DR
R4508 P268 N404 1k
R4509 N404 VSS 4.5k
J_Input240 PC_INC N404 0 DR
J_Input241 Micro_Reset N404 0 DR
J_A2626 N291 SBM N313 DR
J_A2627 N188 SBM P269 DR
R4510 VDD N188 100k
J_F1185 VDD N188 P270 DR
R4511 P270 N237 1k
R4512 N237 VSS 4.8k
J_B1229 P269 Micro7 0 DR
J_A2628 N209 N237 0 DR
R4513 VDD N209 50k
J_F1186 VDD N209 P271 DR
R4514 P271 N257 1k
R4515 N257 VSS 4.5k
J_Input242 Temp_Load N257 0 DR
J_Input243 4004_In N257 0 DR
J_Input244 Subtract_Set N257 0 DR
J_A2629 N376 ADM P272 DR
R4516 VDD N376 100k
J_F1187 VDD N376 P273 DR
R4517 P273 N395 1k
R4518 N395 VSS 4.8k
J_B1230 P272 Micro9 0 DR
J_A2630 N382 N395 0 DR
R4519 VDD N382 50k
J_F1188 VDD N382 P274 DR
R4520 P274 N405 1k
R4521 N405 VSS 4.5k
J_Input245 PC_INC N405 0 DR
J_Input246 Micro_Reset N405 0 DR
J_Input247 Subtract_Reset N405 0 DR
J_A2631 N059 ADD P275 DR
R4522 VDD N059 100k
J_F1189 VDD N059 P276 DR
R4523 P276 N119 1k
R4524 N119 VSS 4.8k
J_B1231 P275 Micro6 0 DR
J_A2632 N086 N119 0 DR
R4525 VDD N086 50k
J_F1190 VDD N086 P277 DR
R4526 P277 N135 1k
R4527 N135 VSS 4.5k
J_A2633 N050 SUB P278 DR
R4528 VDD N050 100k
J_F1191 VDD N050 P279 DR
R4529 P279 N113 1k
R4530 N113 VSS 4.8k
J_B1232 P278 Micro6 0 DR
J_A2634 N078 N113 0 DR
R4531 VDD N078 50k
J_F1192 VDD N078 P280 DR
R4532 P280 N132 1k
R4533 N132 VSS 4.5k
J_Input248 IR2_Out N135 0 DR
J_Input249 IR2_Out N132 0 DR
J_Input250 IndexReg_Load N135 0 DR
J_Input251 IndexReg_Load N132 0 DR
J_A2635 N211 ADD N253 DR
R4534 VDD N211 100k
J_F1193 VDD N211 P281 DR
R4535 P281 N258 1k
R4536 N258 VSS 4.8k
J_B1233 N253 Micro7 0 DR
J_A2636 N231 N258 0 DR
R4537 VDD N231 50k
J_F1194 VDD N231 P282 DR
R4538 P282 N270 1k
R4539 N270 VSS 4.5k
J_Input252 Scratch_Out N270 0 DR
J_Input253 Temp_Load N270 0 DR
J_A2637 N319 ADD N352 DR
R4540 VDD N319 100k
J_F1195 VDD N319 P283 DR
R4541 P283 N358 1k
R4542 N358 VSS 4.8k
J_B1234 N352 Micro8 0 DR
J_A2638 N335 N358 0 DR
R4543 VDD N335 50k
J_F1196 VDD N335 P284 DR
R4544 P284 N366 1k
R4545 N366 VSS 4.5k
J_Input254 EO_Out N416 0 DR
J_Input255 Acc_Load N416 0 DR
J_A2639 N424 ADD P285 DR
R4546 VDD N424 100k
J_F1197 VDD N424 P286 DR
R4547 P286 N433 1k
R4548 N433 VSS 4.8k
J_B1235 P285 Micro10 0 DR
J_A2640 N427 N433 0 DR
R4549 VDD N427 50k
J_F1198 VDD N427 P287 DR
R4550 P287 N436 1k
R4551 N436 VSS 4.5k
J_Input256 PC_INC N436 0 DR
J_Input257 Micro_Reset N436 0 DR
J_Input258 Temp_INV N132 0 DR
J_A2641 N211 SUB N253 DR
J_Input259 CF_Load N436 0 DR
J_Input260 0 N132 0 DR
J_A2643 N319 SUB N352 DR
J_A2644 N425 SUB P288 DR
R4552 VDD N425 100k
J_F1199 VDD N425 P289 DR
R4553 P289 N435 1k
R4554 N435 VSS 4.8k
J_B1236 P288 Micro10 0 DR
J_A2645 N429 N435 0 DR
R4555 VDD N429 50k
J_F1200 VDD N429 P290 DR
R4556 P290 N438 1k
R4557 N438 VSS 4.5k
J_Input261 PC_INC N438 0 DR
J_Input262 Micro_Reset N438 0 DR
J_Input263 CF_Load N438 0 DR
J_Input265 Temp_INV N438 0 DR
J_A2672 N447 ISZ_False P291 DR
R4633 VDD N447 100k
J_F1224 VDD N447 P292 DR
R4634 P292 N451 1k
R4635 N451 VSS 4.8k
J_B1250 P291 ISZ P293 DR
J_A2673 N449 N451 0 DR
R4636 VDD N449 50k
J_F1225 VDD N449 P294 DR
R4637 P294 N453 1k
R4638 N453 VSS 4.5k
J_A2674 P293 Micro12 0 DR
J_A2675 N446 ISZ_True P295 DR
R4639 VDD N446 100k
J_F1226 VDD N446 P296 DR
R4640 P296 N450 1k
R4641 N450 VSS 4.8k
J_B1251 P295 ISZ P297 DR
J_A2676 N448 N450 0 DR
R4642 VDD N448 50k
J_F1227 VDD N448 P298 DR
R4643 P298 N452 1k
R4644 N452 VSS 4.5k
J_A2677 P297 Micro12 0 DR
J_Input77 Micro_Reset N453 0 DR
J_Input102 SYNCHIn Micro1 0 DR
J_A2678 N048 WR N103 DR
R4645 VDD N048 100k
J_F1228 VDD N048 P299 DR
R4646 P299 N111 1k
R4647 N111 VSS 4.8k
J_B1252 N103 Micro6 0 DR
J_A2679 N077 N111 0 DR
R4648 VDD N077 50k
J_F1229 VDD N077 P300 DR
R4649 P300 N131 1k
R4650 N131 VSS 4.5k
J_A2680 IR2_Out N131 0 DR
J_A2681 4004_Out N131 0 DR
J_A2682 N048 RD N103 DR
J_A2683 N048 ADM N103 DR
J_A2684 N048 SBM N103 DR
J_Input267 CMRAM_Load N123 0 DR
J_A3645 CMRAM_Out RAMSignals P301 DR
J_B1137 P301 Micro5 0 DR
J_Input1 P302 Micro4 0 DR
J_Input2 IR1_Load !4Words P005 DR
J_Input3 IR3_Load 4Words P302 DR
J_Input4 P303 Micro5 0 DR
J_Input5 4004_In Micro5 0 DR
J_Input6 P304 Micro5 0 DR
J_Input7 IR2_Load !4Words P303 DR
J_Input8 IR4_Load 4Words P304 DR
J_B1 P001 !4Words P003 DR
J_B2 P014 4Words P016 DR
J_Input10 PC_INC 4Words_Setting 0 DR
J_Input11 Micro_Reset 4Words_Setting 0 DR
J_B3 P023 4Words 0 DR
J_Input12 4Words_Reset N372 0 DR
J_Input13 4Words_Reset N397 0 DR
J_B4 P035 !4Words P037 DR
J_B5 P039 !4Words P041 DR
J_A1 N303 FIN P305 DR
R1 VDD N303 100k
J_F1 VDD N303 P306 DR
R2 P306 N341 1k
R3 N341 VSS 4.8k
J_B6 P307 Micro8 0 DR
J_A2 N316 N341 0 DR
R4 VDD N316 50k
J_F2 VDD N316 P308 DR
R5 P308 N356 1k
R6 N356 VSS 4.5k
J_Input26 PC3_Bus_Load N356 0 DR
J_Input52 Scratch_Out N356 0 DR
J_Input62 ScratchPadWord1 N268 0 DR
J_B7 P305 !4Words P307 DR
J_A3 N398 FIN P309 DR
R7 VDD N398 100k
J_F3 VDD N398 P310 DR
R8 P310 N418 1k
R9 N418 VSS 4.8k
J_B8 P309 Micro9 0 DR
J_A4 N409 N418 0 DR
R10 VDD N409 50k
J_F4 VDD N409 P311 DR
R11 P311 N420 1k
R12 N420 VSS 4.5k
J_Input67 Micro_Reset N420 0 DR
J_Input63 4Words_Reset N420 0 DR
J_Input68 ScratchPad_Load N092 0 DR
J_A5 N016 FIN P312 DR
R13 VDD N016 100k
J_F5 VDD N016 P313 DR
R14 P313 N064 1k
R15 N064 VSS 4.8k
J_B10 P314 Micro6 0 DR
J_A6 N032 N064 0 DR
R16 VDD N032 50k
J_F6 VDD N032 P315 DR
R17 P315 N092 1k
R18 N092 VSS 4.5k
J_Input270 IR3_Out N092 0 DR
J_B11 P312 4Words P314 DR
J_Input268 ScratchPad_Load N261 0 DR
J_A7 N195 FIN P316 DR
R19 VDD N195 100k
J_F7 VDD N195 P317 DR
R20 P317 N245 1k
R21 N245 VSS 4.8k
J_B12 P318 Micro7 0 DR
J_A8 N217 N245 0 DR
R22 VDD N217 50k
J_F8 VDD N217 P319 DR
R23 P319 N261 1k
R24 N261 VSS 4.5k
J_Input272 IR4_Out N261 0 DR
J_B13 P316 4Words P318 DR
J_A9 N309 FIN P320 DR
R25 VDD N309 100k
J_F9 VDD N309 P321 DR
R26 P321 N350 1k
R27 N350 VSS 4.8k
J_B14 P322 Micro8 0 DR
J_A10 N328 N350 0 DR
R28 VDD N328 50k
J_F10 VDD N328 P323 DR
R29 P323 N362 1k
R30 N362 VSS 4.5k
J_B15 P320 4Words P322 DR
J_B16 P043 4Words P045 DR
J_Input19 4Words_Reset N362 0 DR
J_Input20 4Words_Reset N414 0 DR
J_Input55 IndexReg_Load N134 0 DR
J_A11 N057 JIN P324 DR
R31 VDD N057 100k
J_F11 VDD N057 P325 DR
R32 P325 N117 1k
R33 N117 VSS 4.8k
J_B9 P324 Micro6 0 DR
J_A12 N084 N117 0 DR
R34 VDD N084 50k
J_F12 VDD N084 P326 DR
R35 P326 N134 1k
R36 N134 VSS 4.5k
J_Input56 IR2_Out N134 0 DR
J_A13 N218 JIN P327 DR
R37 VDD N218 100k
J_F13 VDD N218 P328 DR
R38 P328 N262 1k
R39 N262 VSS 4.8k
J_B17 P327 Micro7 0 DR
J_A14 N239 N262 0 DR
R40 VDD N239 50k
J_F14 VDD N239 P329 DR
R41 P329 N271 1k
R42 N271 VSS 4.5k
J_Input57 PC2_Bus_Load N271 0 DR
J_Input58 Scratch_Out N271 0 DR
J_A15 N304 JIN P330 DR
R43 VDD N304 100k
J_F15 VDD N304 P331 DR
R44 P331 N342 1k
R45 N342 VSS 4.8k
J_B20 P330 Micro8 0 DR
J_A16 N318 N342 0 DR
R46 VDD N318 50k
J_F16 VDD N318 P332 DR
R47 P332 N357 1k
R48 N357 VSS 4.5k
J_Input66 PC3_Bus_Load N357 0 DR
J_Input69 Scratch_Out N357 0 DR
J_A17 N380 JIN P333 DR
R49 VDD N380 100k
J_F17 VDD N380 P334 DR
R50 P334 N402 1k
R51 N402 VSS 4.8k
J_B22 P333 Micro9 0 DR
J_A18 N389 N402 0 DR
R52 VDD N389 50k
J_F18 VDD N389 P335 DR
R53 P335 N413 1k
R54 N413 VSS 4.5k
J_Input273 Micro_Reset N413 0 DR
J_Input274 4Words_Reset N445 0 DR
J_B18 P057 4Words P059 DR
J_B19 P089 4Words P091 DR
J_Input64 4Words_Reset N452 0 DR
J_Input79 4Words_Reset N453 0 DR
J_A21 N003 !4Words P336 DR
R61 VDD N003 100k
J_F20 VDD N003 P337 DR
R62 P337 N005 1k
R63 N005 VSS 4.8k
J_B21 P336 4Words_Setting P338 DR
J_A22 N009 CLK P339 DR
R64 VDD N009 100k
J_F21 VDD N009 P340 DR
R65 P340 N010 1k
R66 N010 VSS 4.8k
J_B23 P339 4Words_Resetting P341 DR
J_A23 N004 N005 P342 DR
R67 VDD N004 100k
J_F22 VDD N004 P343 DR
R68 P343 N007 1k
R69 N007 VSS 4.8k
J_B24 P342 !4Words 0 DR
J_A24 N008 N007 P344 DR
R70 VDD N008 100k
J_F23 VDD N008 P345 DR
R71 P345 !4Words 1k
R72 !4Words VSS 4.8k
J_B25 P344 N010 0 DR
J_B26 P338 CLK 0 DR
J_B27 P341 N007 0 DR
J_A25 N006 !4Words 0 DR
R73 VDD N006 50k
J_F24 VDD N006 P346 DR
R74 P346 4Words 1k
R75 4Words VSS 4.5k
R76 VDD 4Words_Reset 100k
J_F25 VDD 4Words_Reset P347 DR
R77 P347 N002 1k
R78 N002 VSS 4.8k
J_A26 N001 N002 0 DR
R79 VDD N001 50k
J_A27 VDD N001 P348 DR
R80 P348 4Words_Resetting 1k
R81 4Words_Resetting VSS 4.5k
J_Input37 ScratchPadWord1 N260 0 DR
J_Input14 Scratch_Reg_Select N263 0 DR
J_Input25 Scratch_Reg_Select N264 0 DR
J_Input42 Scratch_Reg_Select N270 0 DR
J_Input48 Scratch_Reg_Select N272 0 DR
J_Input54 Scratch_Reg_Select N370 0 DR
J_Input61 Scratch_Reg_Select N273 0 DR
J_B28 P025 4Words P027 DR
J_Input44 ScratchPadWord2 N315 0 DR
J_Input45 ScratchPadWord2 N356 0 DR
J_Input80 ScratchPadWord1 N092 0 DR
J_Input81 ScratchPadWord2 N261 0 DR
J_Input82 ScratchPadWord1 N271 0 DR
J_Input83 ScratchPadWord2 N357 0 DR
J_Input70 ScratchPadWord1 N254 0 DR
J_Input84 ScratchPadWord2 N360 0 DR
J_Input65 ScratchPad_Load N344 0 DR
J_Input85 INC_Out N344 0 DR
J_B29 P093 4Words P095 DR
J_Input86 Scratch_Reg_Select N351 0 DR
J_Input87 Scratch_Reg_Select N344 0 DR
J_Input89 Shift_Enable N098 0 DR
J_Input90 Temp_Load N098 0 DR
J_A28 N143 RAR P349 DR
R82 VDD N143 100k
J_F26 VDD N143 P350 DR
R83 P350 N165 1k
R84 N165 VSS 4.8k
J_B30 P349 Micro7 0 DR
J_A29 N151 N165 0 DR
R85 VDD N151 50k
J_F27 VDD N151 P351 DR
R86 P351 N183 1k
R87 N183 VSS 4.5k
J_Input91 Temp_Out N183 0 DR
J_Input93 Acc_Load N183 0 DR
J_Input111 CFStage1_Load N098 0 DR
J_B31 P047 4Words P049 DR
J_B32 P061 4Words P063 DR
J_B33 P212 CF P214 DR
J_Input9 Bus1In N116 0 DR
J_A19 N023 TCS P352 DR
R55 VDD N023 100k
J_F19 VDD N023 P353 DR
R56 P353 N081 1k
R57 N081 VSS 4.8k
J_B34 P354 Micro6 0 DR
J_A20 N046 N081 0 DR
R58 VDD N046 50k
J_F28 VDD N046 P355 DR
R59 P355 N109 1k
R60 N109 VSS 4.5k
J_Input28 Bus3In N109 0 DR
J_Input117 Acc_Load N109 0 DR
J_B35 P352 !CF P354 DR
J_Input118 Bus0In N109 0 DR
J_A30 N385 ADD N403 DR
R88 VDD N385 100k
J_F29 VDD N385 P356 DR
R89 P356 N408 1k
R90 N408 VSS 4.8k
J_B36 N403 Micro9 0 DR
J_A31 N393 N408 0 DR
R91 VDD N393 50k
J_F30 VDD N393 P357 DR
R92 P357 N416 1k
R93 N416 VSS 4.5k
J_A32 N385 SUB N403 DR
J_Input180 CFStage1_Load N366 0 DR
J_B37 P175 CF 0 DR
J_A33 N044 CMC P358 DR
R94 VDD N044 100k
J_F31 VDD N044 P359 DR
R95 P359 N107 1k
R96 N107 VSS 4.8k
J_B38 P358 Micro6 P360 DR
J_A34 N071 N107 0 DR
R97 VDD N071 50k
J_F32 VDD N071 P361 DR
R98 P361 N130 1k
R99 N130 VSS 4.5k
J_Input120 CF_Bus_Load N130 0 DR
J_B39 P360 !CF 0 DR
J_Input121 Bus0In N130 0 DR
J_Input179 CF_Load N178 0 DR
J_Input216 CF_Load N183 0 DR
J_Input92 CF_Load N129 0 DR
J_Input110 CF_Load N130 0 DR
J_Input88 CFStage1_Load N097 0 DR
J_A35 N153 DAA P362 DR
R100 VDD N141 100k
J_F33 VDD N141 P363 DR
R101 P363 N157 1k
R102 N157 VSS 4.8k
J_B40 P362 Micro7 0 DR
J_A36 N146 N157 0 DR
R103 VDD N146 50k
J_F34 VDD N146 P364 DR
R104 P364 N168 1k
R105 N168 VSS 4.5k
J_Input199 CFStage1_Load N168 0 DR
J_A37 N141 Acc9 N153 DR
J_A38 N141 CF N153 DR
J_Input221 CF_Bus_Load N108 0 DR
.model NJF NJF
.model PJF PJF
.lib standard.jft
* A1
* A2
* A3
* M1
* M2
* X1
* X2
* NOP
* X3
* JCN
* FIM
* FIN
* JUN
* FETCH WORD 3,4
* JMS
* INC
* ISZ
* XCH
* LD
* BBL
* LDM
* CLB
* CLC
* IAC
* CMA
* CMC
* RAL
* RAR
* TCC
* DAC
* STC
* TCS
* DAA
* KBP
* DCL
* SRC
* WR
* RD
* ADM
* SBM
* ADD
* SUB
* JIN
.backanno
.end